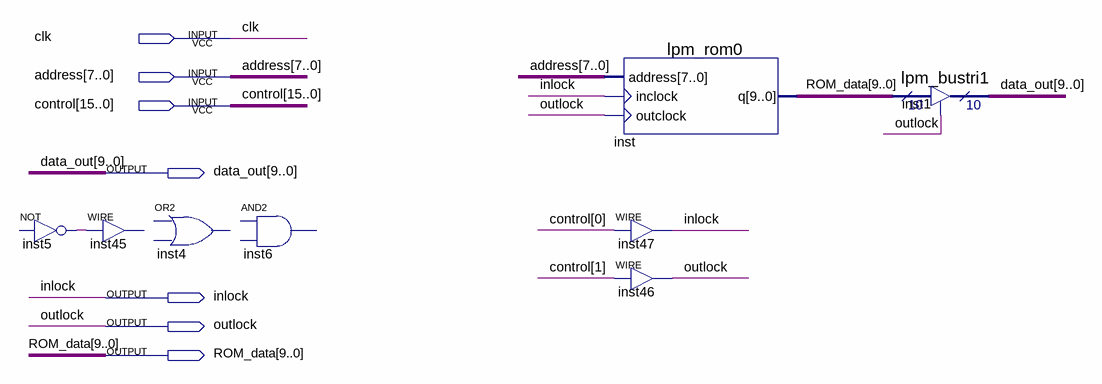
[diagram p0: schematic sheet]
// Quartus schematic ROM.bdf as structural Verilog: 8 symbols, 7 pins
module ROM (
  input  clk,
  input  [7:0] address,
  input  [15:0] control,
  output [9:0] data_out,
  output inlock,
  output outlock,
  output [9:0] ROM_data
);

  wire inst5_out;

  // NOT inst5 has open pins: IN=open, OUT=inst5_out
  // OR2 inst4 is placed but not wired
  // WIRE inst45 has open pins
  // AND2 inst6 is placed but not wired
  lpm_rom0 inst (.address(address), .inclock(inlock), .outclock(outlock), .q(ROM_data));
  assign inlock = control[0];  // WIRE inst47
  assign outlock = control[1];  // WIRE inst46
  lpm_bustri1 inst1 (.enabledt(outlock), .data(ROM_data), .tridata(data_out));
endmodule
